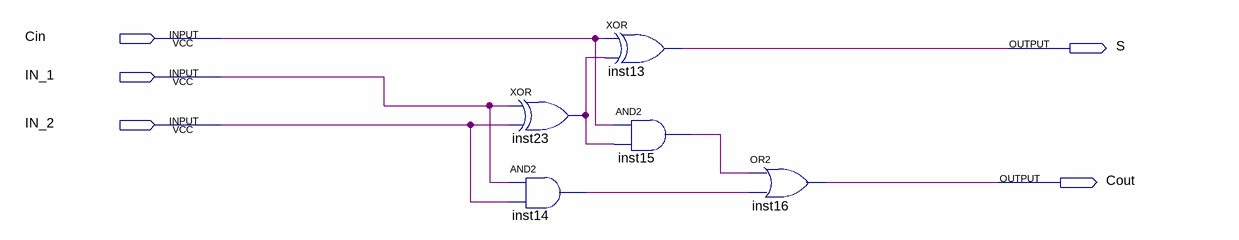
[diagram p0: schematic sheet]
// Quartus schematic g21_1bitAdder.bdf as structural Verilog: 5 symbols, 5 pins
module g21_1bitAdder (
  input  Cin,
  input  IN_1,
  input  IN_2,
  output S,
  output Cout
);

  wire inst14_out, inst15_out, inst23_out;

  xor inst23 (inst23_out, IN_1, IN_2);
  and inst14 (inst14_out, IN_1, IN_2);
  xor inst13 (S, Cin, inst23_out);
  and inst15 (inst15_out, Cin, inst23_out);
  or inst16 (Cout, inst15_out, inst14_out);
endmodule
